# Altium project Display.PrjPcb
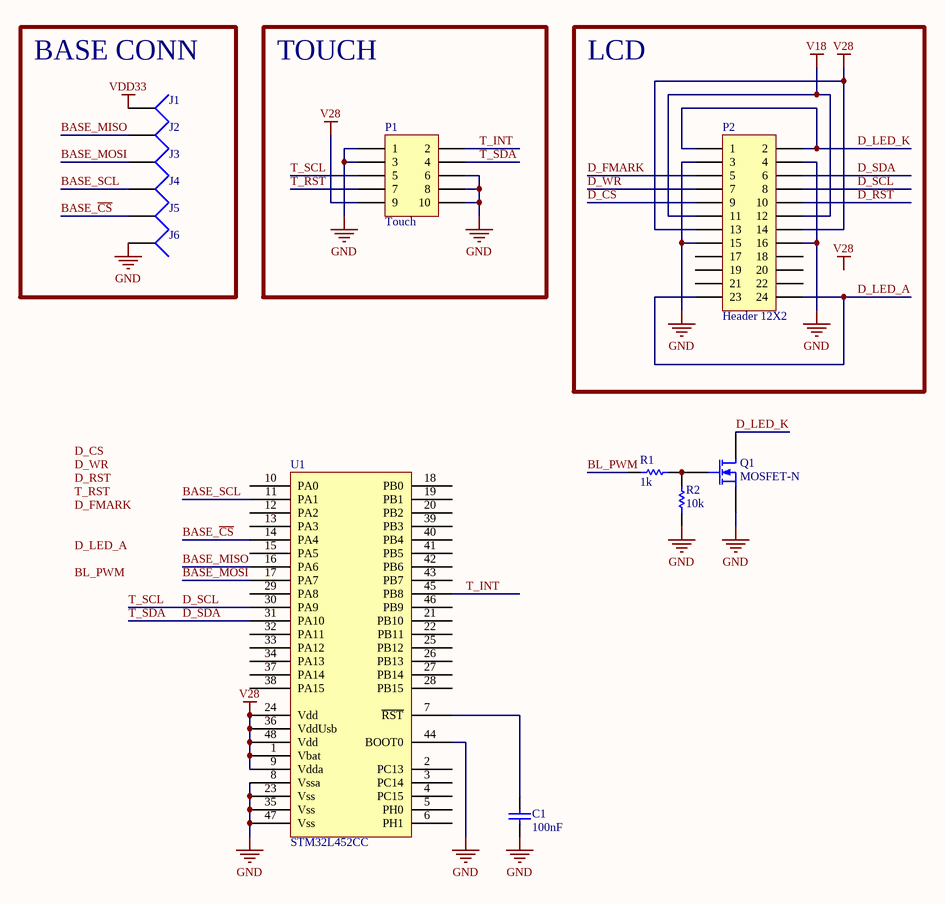
[diagram p0: display_schematic.SchDoc]
1 sheet, 13 parts. Net scope: global (net labels, ports and power ports of the same name join across sheets).
Board file: display_pcb.PcbDoc

## Sheet display_schematic.SchDoc
size A4

### Parts
C1  100nF  [RAD-0.3]
J1  Socket  [PIN1]  (value not drawn)
J2  Socket  [PIN1]  (value not drawn)
J3  Socket  [PIN1]  (value not drawn)
J4  Socket  [PIN1]  (value not drawn)
J5  Socket  [PIN1]  (value not drawn)
J6  Socket  [PIN1]  (value not drawn)
P1  Touch  [HRS_DF37C-10DP-0.4V(51)]
P2  Header 12X2  [HRS_DF37C-24DP-0.4V(51)]
Q1  MOSFET-N  [E3]
R1  1k  [AXIAL-0.3]
R2  10k  [AXIAL-0.3]
U1  STM32L452CC

### Blocks framed on the sheet
BASE CONN: J1-J6
TOUCH: P1
LCD: P2

### Nets
GND: C1.1 J6.1 P1.1 P1.3 P1.6 P1.8 P1.10 P2.3 P2.4 P2.15 P2.16 Q1.3(S) R2.1 U1.8(Vssa) U1.23(Vss) U1.35(Vss) U1.44(BOOT0) U1.47(Vss)
V18: P2.11 P2.12
V28: P1.9 P2.13 P2.14 U1.1(Vbat) U1.9(Vdda) U1.24(Vdd) U1.36(VddUsb) U1.48(Vdd)
VDD33: J1.1
BASE_~{CS}: J5.1 U1.14(PA4)
BASE_MISO: J2.1 U1.16(PA6)
BASE_MOSI: J3.1 U1.17(PA7)
BASE_SCL: J4.1 U1.11(PA1)
BL_PWM: R1.1
D_CS: P2.9
D_FMARK: P2.5
D_LED_A: P2.23 P2.24
D_LED_K: P2.1 P2.2 Q1.1(D)
D_RST: P2.10
D_SCL: P1.5 P2.8 U1.30(PA9)  [also labelled T_SCL]
D_SDA: P1.4 P2.6 U1.31(PA10)  [also labelled T_SDA]
D_WR: P2.7
T_INT: P1.2 U1.45(PB8)
T_RST: P1.7
NetC1_2: C1.2 U1.7(~{RST})
NetQ1_2: Q1.2(G) R1.2 R2.2

Not connected (* = marked no-connect by the designer): P2 17 18 19 20 21 22; U1 2(PC13) 3(PC14) 4(PC15) 5(PH0) 6(PH1) 10(PA0) 12(PA2) 13(PA3) 15(PA5) 18(PB0) 19(PB1) 20(PB2) 21(PB10) 22(PB11) 25(PB12) 26(PB13) 27(PB14) 28(PB15) 29(PA8) 32(PA11) 33(PA12) 34(PA13) 37(PA14) 38(PA15) 39(PB3) 40(PB4) 41(PB5) 42(PB6) 43(PB7) 46(PB9)

### Notes on the sheet
- Labels drawn without touching a wire or pin: BL_PWM, D_CS, D_FMARK, D_LED_A, D_RST, D_WR, T_RST, V28

### Library data of the parts
C1 = Cap: Capacitor; Value: 100pF; Published: 8-Jun-2000; LatestRevisionDate: 17-Jul-2002; LatestRevisionNote: Re-released for DXP Platform.; PackageReference: RAD-0.3; Publisher: Altium Limited; PackageDescription: Radial Cap, Thru-Hole; 2 Leads; 0.3 in Pin Spacing
P1 = Header 5X2: Header, 5-Pin, Dual row; LatestRevisionDate: 17-Jul-2002; LatestRevisionNote: Re-released for DXP Platform.; Publisher: Altium Limited
P2 = Header 12X2: Header, 12-Pin, Dual row; LatestRevisionDate: 17-Jul-2002; LatestRevisionNote: Re-released for DXP Platform.; Publisher: Altium Limited
Q1 = MOSFET-N: N-Channel MOSFET; Published: 8-Jun-2000; LatestRevisionDate: 17-Jul-2002; LatestRevisionNote: Re-released for DXP Platform.; PackageVersion: 1995/1996; PackageReference: E3; Publisher: Altium Limited; PackageDescription: TO, Flat Index; 3 In-Line, Axial Leads; Body Dia. 4.6mm; Lead Dia. 0.5 mm (max)
R1 = Res1: Resistor; Published: 8-Jun-2000; LatestRevisionDate: 17-Jul-2002; LatestRevisionNote: Re-released for DXP Platform.; PackageReference: AXIAL-0.3; Publisher: Altium Limited; PackageDescription: Axial Device, Thru-Hole; 2 Leads; 0.3 in Pin Spacing; Value: 1K
R2 = Res1: Resistor; Value: 1K; Published: 8-Jun-2000; LatestRevisionDate: 17-Jul-2002; LatestRevisionNote: Re-released for DXP Platform.; PackageReference: AXIAL-0.3; Publisher: Altium Limited; PackageDescription: Axial Device, Thru-Hole; 2 Leads; 0.3 in Pin Spacing
U1 = STN32L452CC
J1-J6 = Socket: LatestRevisionDate: 17-Jul-2002; LatestRevisionNote: Re-released for DXP Platform.; Publisher: Altium Limited